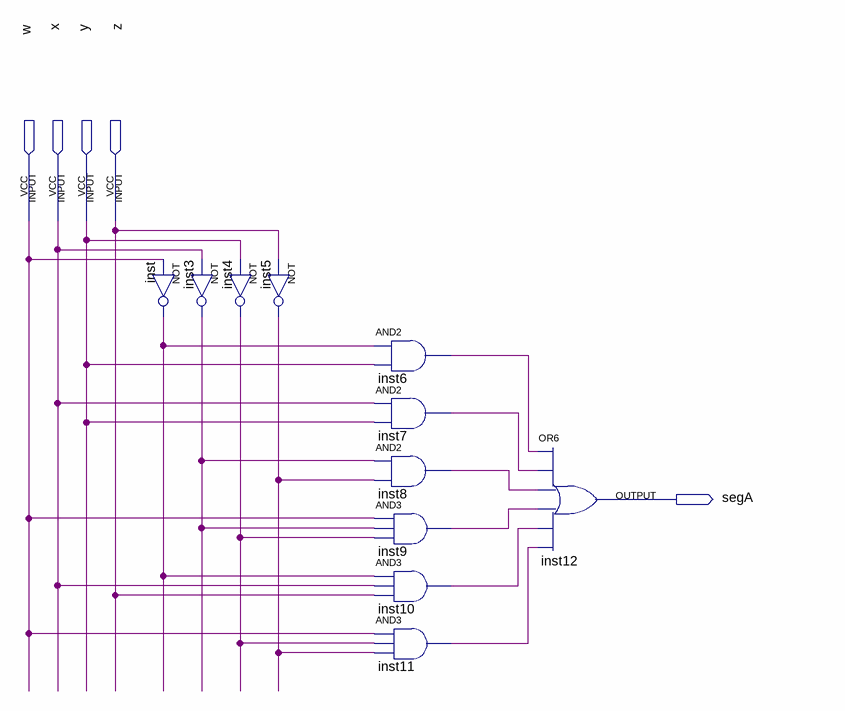
[diagram p0: schematic sheet]
// Quartus schematic segA.bdf as structural Verilog: 11 symbols, 5 pins
module segA (
  input  w,
  input  x,
  input  y,
  input  z,
  output segA
);

  wire inst3_out, inst4_out, inst5_out, inst6_out, inst7_out, inst8_out, inst9_out, inst10_out, inst11_out,
       inst_out;

  not inst (inst_out, w);
  not inst3 (inst3_out, x);
  not inst4 (inst4_out, y);
  not inst5 (inst5_out, z);
  and inst6 (inst6_out, inst_out, y);
  and inst7 (inst7_out, x, y);
  and inst8 (inst8_out, inst3_out, inst5_out);
  and inst9 (inst9_out, w, inst3_out, inst4_out);
  and inst10 (inst10_out, inst_out, x, z);
  and inst11 (inst11_out, w, inst4_out, inst5_out);
  or inst12 (segA, inst6_out, inst7_out, inst8_out, inst9_out, inst10_out, inst11_out);
endmodule
